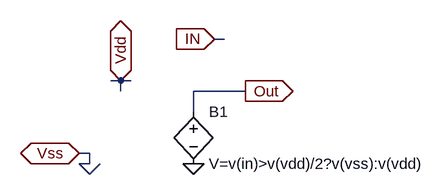
[diagram p0: schematic inv.asc]
inv.asc, the LTspice schematic file:
Version 4.1
SHEET 1 6308 700
WIRE 2144 -304 2128 -304
WIRE 1984 -240 1968 -240
WIRE 2000 -240 1984 -240
WIRE 1984 -224 1984 -240
WIRE 2176 -224 2096 -224
WIRE 2096 -192 2096 -224
WIRE 1936 -128 1920 -128
WIRE 1936 -112 1936 -128
WIRE 1936 -112 1920 -112
WIRE 1936 -96 1920 -112
WIRE 1936 -96 1952 -112
FLAG 1984 -240 Vdd
IOPIN 1984 -240 BiDir
FLAG 2176 -224 Out
IOPIN 2176 -224 Out
FLAG 1920 -128 Vss
IOPIN 1920 -128 BiDir
FLAG 2128 -304 IN
IOPIN 2128 -304 In
FLAG 2096 -112 0
SYMBOL bv 2096 -208 R0
SYMATTR InstName B1
SYMATTR Value V=v(in)>v(vdd)/2?v(vss):v(vdd)

The netlist it stands for:
* inv.asc
B1 Out 0 V=v(in)>v(vdd)/2?v(vss):v(vdd)
.backanno
.end